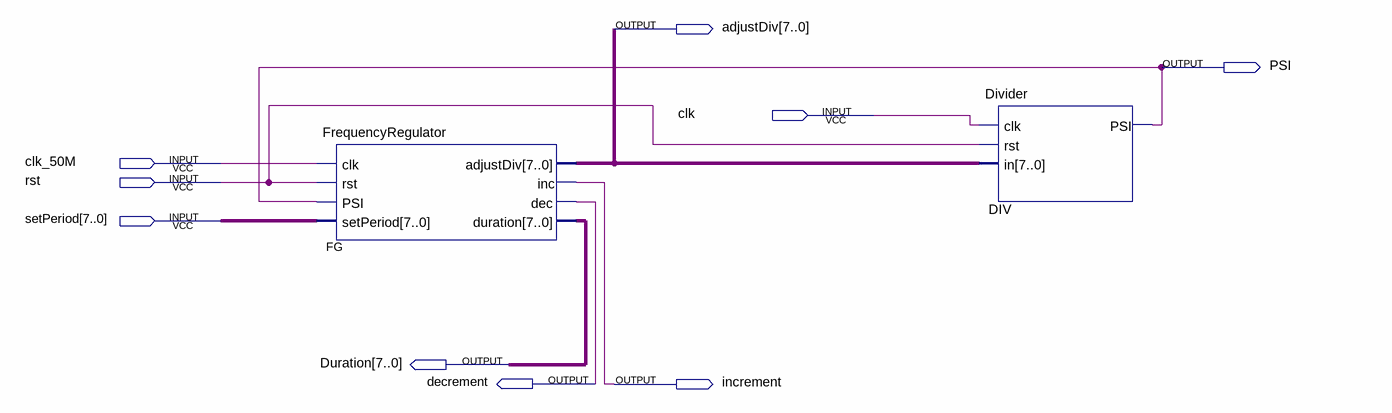
[diagram p0: schematic sheet]
// Quartus schematic FrequencyRegulatorAndDivider.bdf as structural Verilog: 2 symbols, 9 pins
module FrequencyRegulatorAndDivider (
  input  clk,
  input  clk_50M,
  input  rst,
  input  [7:0] setPeriod,
  output [7:0] adjustDiv,
  output PSI,
  output [7:0] Duration,
  output decrement,
  output increment
);

  FrequencyRegulator FG (
    .clk(clk_50M), .rst(rst), .PSI(PSI), .setPeriod(setPeriod), .adjustDiv(adjustDiv), .inc(increment),
    .dec(decrement), .duration(Duration));
  Divider DIV (.clk(clk), .rst(rst), .in(adjustDiv), .PSI(PSI));
endmodule
